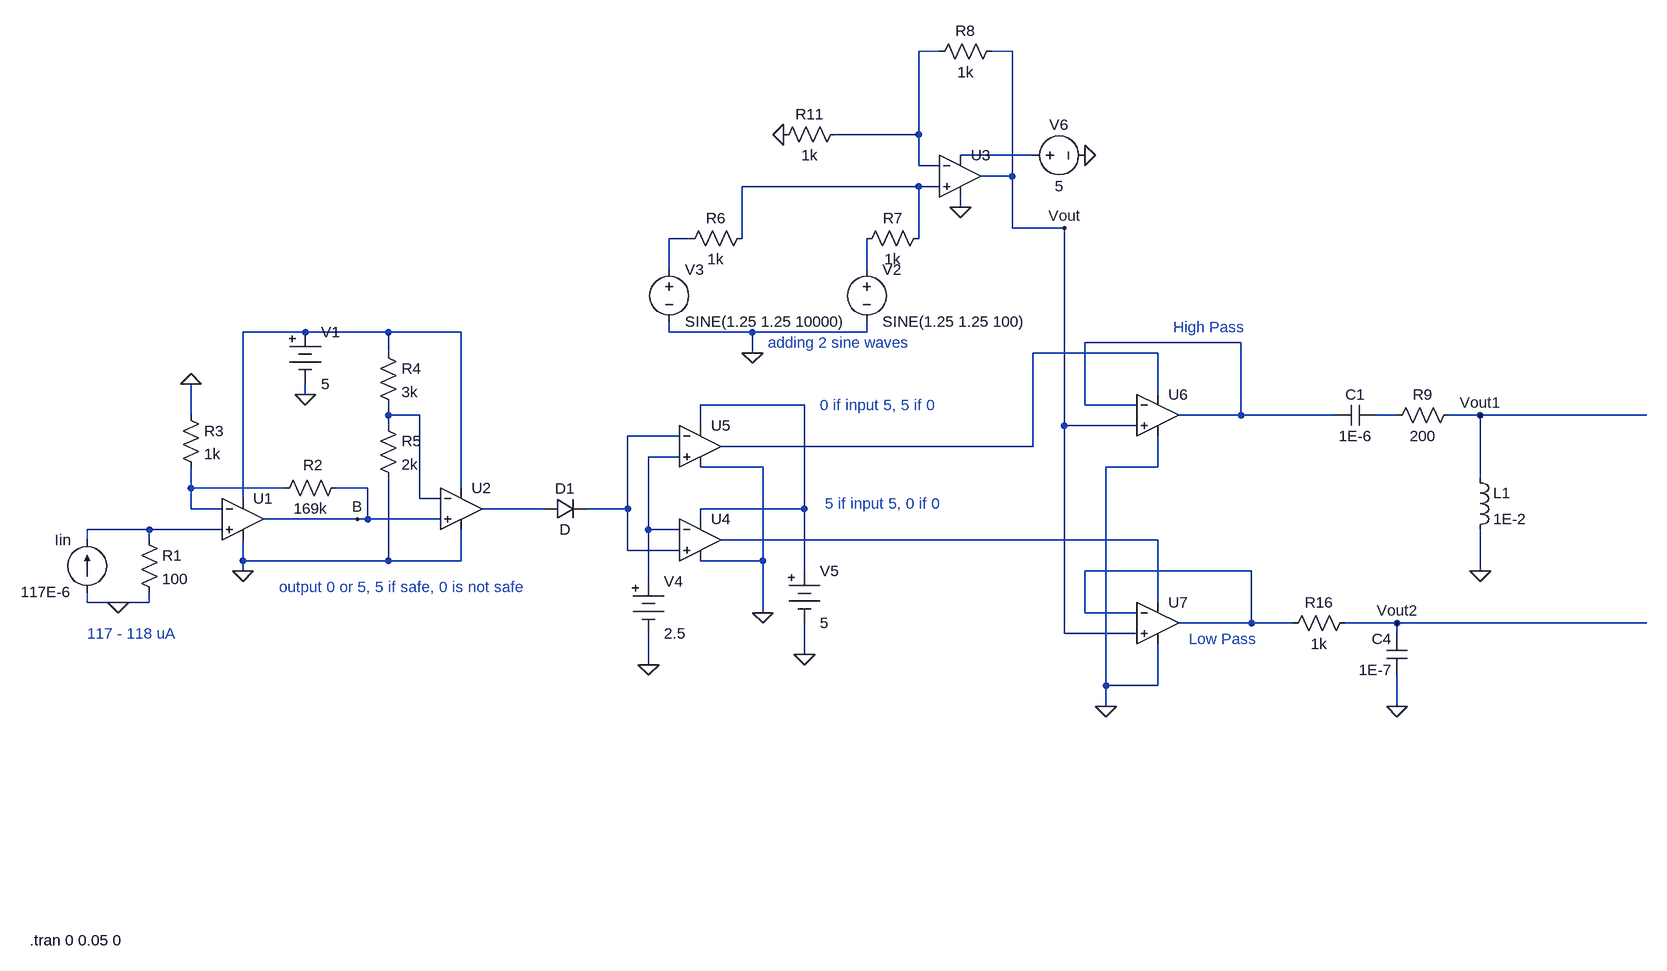
[diagram p0: schematic oxygen_sensor_schematic.asc]
oxygen_sensor_schematic.asc, the LTspice schematic file:
Version 4
SHEET 1 3036 1032
WIRE 1104 -352 1072 -352
WIRE 1216 -352 1184 -352
WIRE 1072 -224 1072 -352
WIRE 1072 -224 944 -224
WIRE 1248 -192 1136 -192
WIRE 1072 -176 1072 -224
WIRE 1104 -176 1072 -176
WIRE 1216 -160 1216 -352
WIRE 1216 -160 1168 -160
WIRE 1072 -144 800 -144
WIRE 1104 -144 1072 -144
WIRE 1136 -112 1136 -128
WIRE 1216 -80 1216 -160
WIRE 1296 -80 1216 -80
WIRE 720 -64 688 -64
WIRE 800 -64 800 -144
WIRE 1072 -64 1072 -144
WIRE 688 -16 688 -64
WIRE 992 -16 992 -64
WIRE 128 80 32 80
WIRE 256 80 128 80
WIRE 368 80 256 80
WIRE 688 80 688 64
WIRE 816 80 688 80
WIRE 992 80 992 64
WIRE 992 80 816 80
WIRE 1568 96 1328 96
WIRE 256 112 256 80
WIRE 816 112 816 80
WIRE 1440 112 1248 112
WIRE 128 176 128 160
WIRE 1440 176 1440 112
WIRE 896 192 736 192
WIRE 1328 192 1328 96
WIRE 1408 192 1328 192
WIRE -48 208 -48 160
WIRE 256 208 256 192
WIRE 304 208 256 208
WIRE 1568 208 1568 96
WIRE 1568 208 1472 208
WIRE 1712 208 1568 208
WIRE 1808 208 1776 208
WIRE 1936 208 1888 208
WIRE 2192 208 1936 208
WIRE 256 224 256 208
WIRE 736 224 736 192
WIRE 1296 224 1296 -80
WIRE 1408 224 1296 224
WIRE 704 240 624 240
WIRE 1248 256 1248 112
WIRE 1248 256 768 256
WIRE 704 272 656 272
WIRE 832 288 736 288
WIRE 1440 288 1440 240
WIRE 1440 288 1360 288
WIRE 1936 304 1936 208
WIRE -48 320 -48 288
WIRE 96 320 -48 320
WIRE 224 320 176 320
WIRE 368 320 368 80
WIRE 32 336 32 80
WIRE 304 336 304 208
WIRE 336 336 304 336
WIRE -48 352 -48 320
WIRE 0 352 -48 352
WIRE 496 352 400 352
WIRE 624 352 624 240
WIRE 624 352 560 352
WIRE 896 352 896 192
WIRE 896 352 736 352
WIRE 208 368 64 368
WIRE 224 368 224 320
WIRE 224 368 208 368
WIRE 336 368 224 368
WIRE 736 368 736 352
WIRE -112 384 -208 384
WIRE 0 384 -112 384
WIRE 656 384 656 272
WIRE 704 384 656 384
WIRE -208 400 -208 384
WIRE -112 400 -112 384
WIRE 1440 400 768 400
WIRE 624 416 624 352
WIRE 704 416 624 416
WIRE 32 432 32 400
WIRE 256 432 256 304
WIRE 256 432 32 432
WIRE 368 432 368 384
WIRE 368 432 256 432
WIRE 832 432 832 288
WIRE 832 432 736 432
WIRE 32 448 32 432
WIRE 896 448 896 352
WIRE 1584 448 1328 448
WIRE 1936 448 1936 384
WIRE 656 464 656 384
WIRE -208 496 -208 480
WIRE -160 496 -208 496
WIRE -112 496 -112 480
WIRE -112 496 -160 496
WIRE 1440 496 1440 400
WIRE 832 512 832 432
WIRE 1328 512 1328 448
WIRE 1408 512 1328 512
WIRE 1584 528 1584 448
WIRE 1584 528 1472 528
WIRE 1648 528 1584 528
WIRE 1808 528 1728 528
WIRE 2192 528 1808 528
WIRE 1296 544 1296 224
WIRE 1408 544 1296 544
WIRE 1808 544 1808 528
WIRE 896 576 896 528
WIRE 656 592 656 544
WIRE 1360 624 1360 288
WIRE 1440 624 1440 560
WIRE 1440 624 1360 624
WIRE 1360 656 1360 624
WIRE 1808 656 1808 608
FLAG 128 176 0
FLAG 32 448 0
FLAG -160 496 0
FLAG -48 160 0
FLAG 208 368 B
FLAG 656 592 0
FLAG 832 512 0
FLAG 896 576 0
FLAG 1360 656 0
FLAG 816 112 0
FLAG 1136 -112 0
FLAG 1328 -192 0
FLAG 864 -224 0
FLAG 1296 -80 Vout
FLAG 1808 656 0
FLAG 1936 448 0
FLAG 1936 208 Vout1
FLAG 1808 528 Vout2
SYMBOL Misc\\battery 128 64 R0
WINDOW 123 0 0 Left 0
WINDOW 39 0 0 Left 0
SYMATTR InstName V1
SYMATTR Value 5
SYMBOL current -208 480 R180
WINDOW 0 24 80 Left 2
WINDOW 3 24 0 Left 2
WINDOW 123 0 0 Left 0
WINDOW 39 0 0 Left 0
SYMATTR InstName Iin
SYMATTR Value 117E-6
SYMBOL res -128 384 R0
SYMATTR InstName R1
SYMATTR Value 100
SYMBOL OpAmps\\UniversalOpamp2 32 368 R0
SYMATTR InstName U1
SYMBOL res 192 304 R90
WINDOW 0 -4 52 VBottom 2
WINDOW 3 32 56 VTop 2
SYMATTR InstName R2
SYMATTR Value 169k
SYMBOL res -64 192 R0
SYMATTR InstName R3
SYMATTR Value 1k
SYMBOL OpAmps\\UniversalOpamp2 368 352 R0
SYMATTR InstName U2
SYMBOL res 240 96 R0
SYMATTR InstName R4
SYMATTR Value 3k
SYMBOL res 240 208 R0
SYMATTR InstName R5
SYMATTR Value 2k
SYMBOL OpAmps\\UniversalOpamp2 736 400 R0
SYMATTR InstName U4
SYMBOL OpAmps\\UniversalOpamp2 736 256 R0
SYMATTR InstName U5
SYMBOL Misc\\battery 656 448 R0
WINDOW 123 0 0 Left 0
WINDOW 39 0 0 Left 0
SYMATTR InstName V4
SYMATTR Value 2.5
SYMBOL Misc\\battery 896 432 R0
WINDOW 123 0 0 Left 0
WINDOW 39 0 0 Left 0
SYMATTR InstName V5
SYMATTR Value 5
SYMBOL OpAmps\\UniversalOpamp2 1440 208 R0
SYMATTR InstName U6
SYMBOL OpAmps\\UniversalOpamp2 1440 528 R0
SYMATTR InstName U7
SYMBOL diode 496 368 R270
WINDOW 0 32 32 VTop 2
WINDOW 3 0 32 VBottom 2
SYMATTR InstName D1
SYMBOL voltage 992 -32 R0
WINDOW 123 0 0 Left 0
WINDOW 39 0 0 Left 0
SYMATTR InstName V2
SYMATTR Value SINE(1.25 1.25 100)
SYMBOL voltage 688 -32 R0
WINDOW 123 0 0 Left 0
WINDOW 39 0 0 Left 0
SYMATTR InstName V3
SYMATTR Value SINE(1.25 1.25 10000)
SYMBOL res 704 -48 R270
WINDOW 0 32 56 VTop 2
WINDOW 3 0 56 VBottom 2
SYMATTR InstName R6
SYMATTR Value 1k
SYMBOL res 976 -48 R270
WINDOW 0 32 56 VTop 2
WINDOW 3 0 56 VBottom 2
SYMATTR InstName R7
SYMATTR Value 1k
SYMBOL res 1200 -368 R90
WINDOW 0 0 56 VBottom 2
WINDOW 3 32 56 VTop 2
SYMATTR InstName R8
SYMATTR Value 1k
SYMBOL OpAmps\\UniversalOpamp2 1136 -160 R0
SYMATTR InstName U3
SYMBOL voltage 1232 -192 R270
WINDOW 0 32 56 VTop 2
WINDOW 3 -32 56 VBottom 2
WINDOW 123 0 0 Left 0
WINDOW 39 0 0 Left 0
SYMATTR InstName V6
SYMATTR Value 5
SYMBOL res 960 -240 R90
WINDOW 0 0 56 VBottom 2
WINDOW 3 32 56 VTop 2
SYMATTR InstName R11
SYMATTR Value 1k
SYMBOL cap 1824 608 R180
WINDOW 0 24 56 Left 2
WINDOW 3 24 8 Left 2
SYMATTR InstName C4
SYMATTR Value 1E-7
SYMBOL res 1744 512 R90
WINDOW 0 0 56 VBottom 2
WINDOW 3 32 56 VTop 2
SYMATTR InstName R16
SYMATTR Value 1k
SYMBOL cap 1776 192 R90
WINDOW 0 0 32 VBottom 2
WINDOW 3 32 32 VTop 2
SYMATTR InstName C1
SYMATTR Value 1E-6
SYMBOL res 1904 192 R90
WINDOW 0 0 56 VBottom 2
WINDOW 3 32 56 VTop 2
SYMATTR InstName R9
SYMATTR Value 200
SYMBOL ind 1920 288 R0
SYMATTR InstName L1
SYMATTR Value 1E-2
TEXT 920 192 Left 2 ;0 if input 5, 5 if 0
TEXT 928 344 Left 2 ;5 if input 5, 0 if 0
TEXT 88 472 Left 2 ;output 0 or 5, 5 if safe, 0 is not safe
TEXT 1464 72 Left 2 ;High Pass
TEXT 1488 552 Left 2 ;Low Pass
TEXT -296 1016 Left 2 !.tran 0 0.05 0
TEXT 840 96 Left 2 ;adding 2 sine waves
TEXT -208 544 Left 2 ;117 - 118 uA

The netlist it stands for:
* oxygen_sensor_schematic.asc
V1 N006 0 5
Iin 0 N016 117E-6
R1 N016 0 100
XU1 N016 N014 N006 0 B level.2 Avol=1Meg GBW=10Meg Slew=10Meg ilimit=25m rail=0 Vos=0 phimargin=45 en=0 enk=0 in=0 ink=0 Rin=500Meg  ; pins IN+ IN- V+ V- OUT
R2 B N014 169k
R3 0 N014 1k
XU2 B N010 N006 0 N015 level.2 Avol=1Meg GBW=10Meg Slew=10Meg ilimit=25m rail=0 Vos=0 phimargin=45 en=0 enk=0 in=0 ink=0 Rin=500Meg  ; pins IN+ IN- V+ V- OUT
R4 N006 N010 3k
R5 N010 0 2k
XU4 N012 N013 N009 0 N017 level.2 Avol=1Meg GBW=10Meg Slew=10Meg ilimit=25m rail=0 Vos=0 phimargin=45 en=0 enk=0 in=0 ink=0 Rin=500Meg  ; pins IN+ IN- V+ V- OUT
XU5 N013 N012 N009 0 N008 level.2 Avol=1Meg GBW=10Meg Slew=10Meg ilimit=25m rail=0 Vos=0 phimargin=45 en=0 enk=0 in=0 ink=0 Rin=500Meg  ; pins IN+ IN- V+ V- OUT
V4 N013 0 2.5
V5 N009 0 5
XU6 Vout N007 N008 0 N007 level.2 Avol=1Meg GBW=10Meg Slew=10Meg ilimit=25m rail=0 Vos=0 phimargin=45 en=0 enk=0 in=0 ink=0 Rin=500Meg  ; pins IN+ IN- V+ V- OUT
XU7 Vout N018 N017 0 N018 level.2 Avol=1Meg GBW=10Meg Slew=10Meg ilimit=25m rail=0 Vos=0 phimargin=45 en=0 enk=0 in=0 ink=0 Rin=500Meg  ; pins IN+ IN- V+ V- OUT
D1 N015 N012 D
V2 N005 0 SINE(1.25 1.25 100)
V3 N004 0 SINE(1.25 1.25 10000)
R6 N004 N003 1k
R7 N005 N003 1k
R8 Vout N001 1k
XU3 N003 N001 N002 0 Vout level.2 Avol=1Meg GBW=10Meg Slew=10Meg ilimit=25m rail=0 Vos=0 phimargin=45 en=0 enk=0 in=0 ink=0 Rin=500Meg  ; pins IN+ IN- V+ V- OUT
V6 N002 0 5
R11 N001 0 1k
C4 0 Vout2 1E-7
R16 Vout2 N018 1k
C1 N011 N007 1E-6
R9 Vout1 N011 200
L1 Vout1 0 1E-2
.model D D
.lib standard.dio
* 0 if input 5, 5 if 0
* 5 if input 5, 0 if 0
* output 0 or 5, 5 if safe, 0 is not safe
* High Pass
* Low Pass
.tran 0 0.05 0
* adding 2 sine waves
* 117 - 118 uA
.lib UniversalOpamps2.sub
.backanno
.end